# EAGLE design proto3 (EAGLE 6.1)
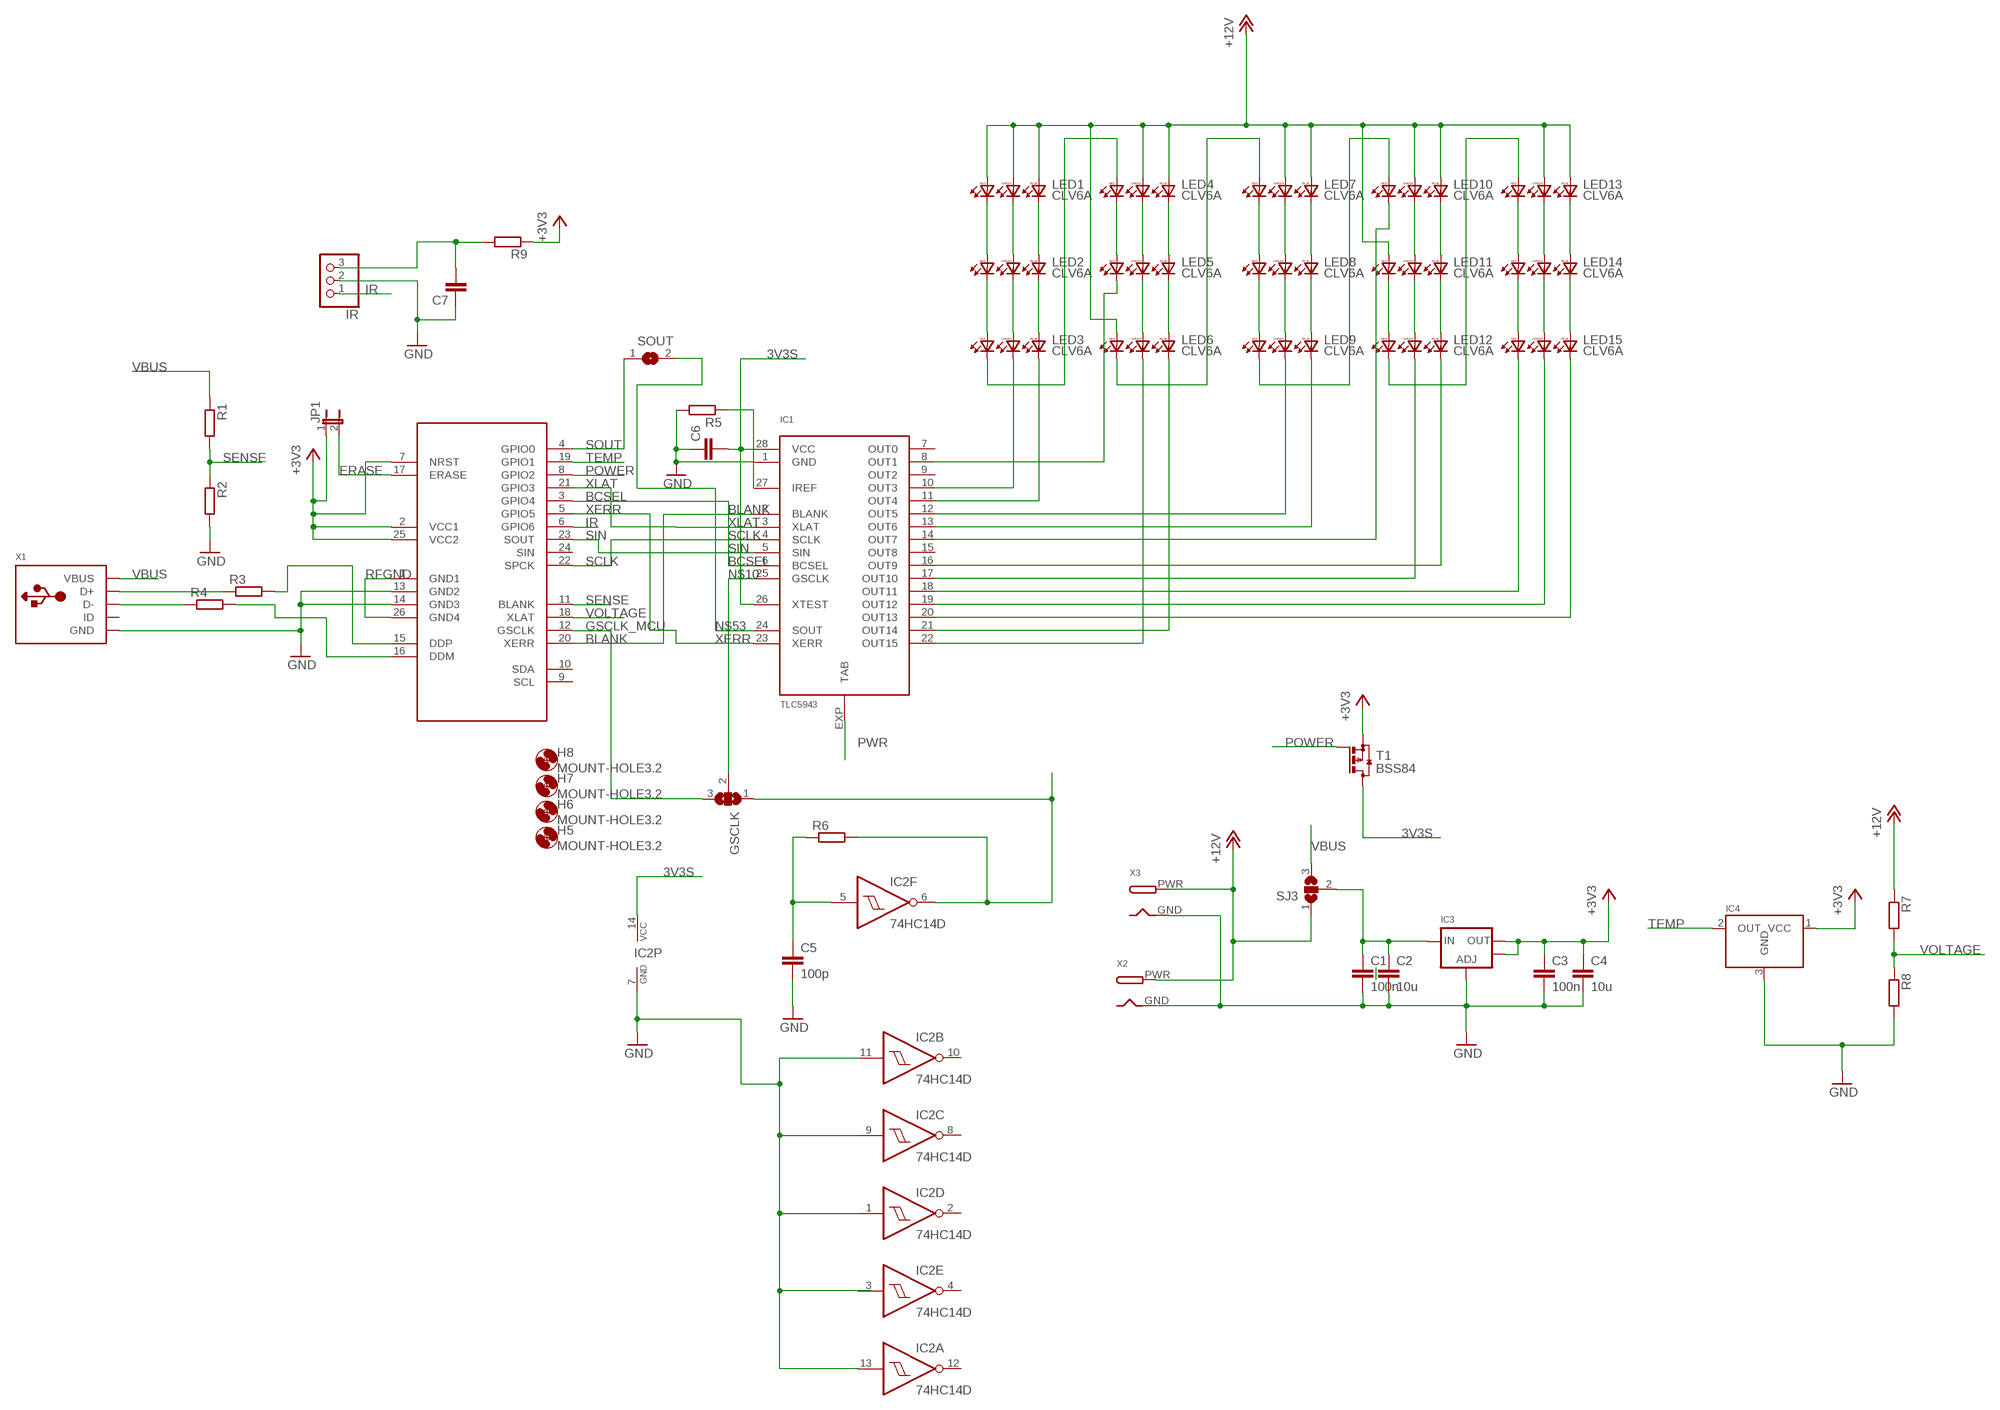
[diagram p0: schematic, sheet 1]

## Parts
C1  100n  C-EUC0805  [C0805]
C2  10u  C-EUC0805  [C0805]
C3  100n  C-EUC0805  [C0805]
C4  10u  C-EUC0805  [C0805]
C5  100p  C-EUC0805  [C0805]
C6  C-EUC0805  [C0805]
C7  C-EUC0805  [C0805]
GSCLK  SJ2W  [SJ_2]
H5  MOUNT-HOLE3.2  [3,2]
H6  MOUNT-HOLE3.2  [3,2]
H7  MOUNT-HOLE3.2  [3,2]
H8  MOUNT-HOLE3.2  [3,2]
IC1  TLC5943  [HTSSOP28PWP]
IC2  74HC14D  [SO14]
IC3  LM1117SOT223-REFLOW  [SOT223-R]
IC4  MCP9701T-E/TTCTREFLOW  [SOT23-R]
IR  PINHD-1X3  [1X03]
JP1  JP1E  [JP1]
LED1  CLV6A  [PLCC6]
LED2  CLV6A  [PLCC6]
LED3  CLV6A  [PLCC6]
LED4  CLV6A  [PLCC6]
LED5  CLV6A  [PLCC6]
LED6  CLV6A  [PLCC6]
LED7  CLV6A  [PLCC6]
LED8  CLV6A  [PLCC6]
LED9  CLV6A  [PLCC6]
LED10  CLV6A  [PLCC6]
LED11  CLV6A  [PLCC6]
LED12  CLV6A  [PLCC6]
LED13  CLV6A  [PLCC6]
LED14  CLV6A  [PLCC6]
LED15  CLV6A  [PLCC6]
R1  R-EU_R0805  [R0805]
R2  R-EU_R0805  [R0805]
R3  R-EU_R0805  [R0805]
R4  R-EU_R0805  [R0805]
R5  R-EU_R0805  [R0805]
R6  R-EU_R0805  [R0805]
R7  R-EU_R0805  [R0805]
R8  R-EU_R0805  [R0805]
R9  R-EU_R0805  [R0805]
SJ3  SJ2W  [SJ_2]
SOUT  SJ  [SJ]
T1  BSS84  [SOT23]
U$1  RFBOARD  [RFBOARD]
X1  USBMINIB  [USB-MINIB]
X2  DCBARRELPTH  [DCJACK_2MM_PTH]
X3  DCBARRELPTH  [DCJACK_2MM_PTH]

## Nets
3V3S: C6.2 IC1.26(XTEST) IC1.28(VCC) IC2.14(P:VCC) T1.3(D)
+3V3: C3.1 C4.1 IC3.2(OUT) IC3.4(OUT1) IC4.1(VCC) JP1.1 R9.1 T1.2(S) U$1.2(VCC1) U$1.7(NRST) U$1.25(VCC2)
+12V: LED1.4(RA) LED1.5(GA) LED1.6(BA) LED4.5(GA) LED4.6(BA) LED6.4(RA) LED7.5(GA) LED7.6(BA) LED10.5(GA) LED10.6(BA) LED11.4(RA) LED13.5(GA) LED13.6(BA) R7.1 SJ3.1 X2.PWR X3.PWR
BCSEL: IC1.6(BCSEL) U$1.3(GPIO4)
BLANK: IC1.2(BLANK) U$1.20(XERR)
ERASE: JP1.2 U$1.17(ERASE)
GND: C1.2 C2.2 C3.2 C4.2 C5.2 C6.1 C7.1 IC1.1(GND) IC2.1(D:I) IC2.7(P:GND) IC2.9(C:I) IC2.11(B:I) IC2.13(A:I) IC3.1(ADJ) IC4.3(GND) IR.2 R2.2 R5.2 R8.2 U$1.13(GND2) U$1.14(GND3) X1.GND X2.GND X3.GND
GSCLK_MCU: GSCLK.3 U$1.12(GSCLK)
IR: IR.1 U$1.6(GPIO6)
N$1: LED1.3(RC) LED2.4(RA)
N$2: LED1.2(GC) LED2.5(GA)
N$3: LED1.1(BC) LED2.6(BA)
N$4: LED2.3(RC) LED3.4(RA)
N$5: LED2.2(GC) LED3.5(GA)
N$6: LED2.1(BC) LED3.6(BA)
N$7: LED4.3(RC) LED5.4(RA)
N$8: LED4.2(GC) LED5.5(GA)
N$9: LED4.1(BC) LED5.6(BA)
N$10: GSCLK.2 IC1.25(GSCLK)
N$11: LED5.2(GC) LED6.5(GA)
N$12: LED5.1(BC) LED6.6(BA)
N$13: LED7.3(RC) LED8.4(RA)
N$14: LED7.2(GC) LED8.5(GA)
N$15: LED7.1(BC) LED8.6(BA)
N$16: LED8.3(RC) LED9.4(RA)
N$17: LED8.2(GC) LED9.5(GA)
N$18: LED8.1(BC) LED9.6(BA)
N$19: IC1.10(OUT3) LED3.2(GC)
N$20: LED10.2(GC) LED11.5(GA)
N$21: LED10.1(BC) LED11.6(BA)
N$22: LED11.3(RC) LED12.4(RA)
N$23: LED11.2(GC) LED12.5(GA)
N$24: LED11.1(BC) LED12.6(BA)
N$25: LED13.3(RC) LED14.4(RA)
N$26: LED13.2(GC) LED14.5(GA)
N$27: LED13.1(BC) LED14.6(BA)
N$28: LED14.3(RC) LED15.4(RA)
N$29: LED14.2(GC) LED15.5(GA)
N$30: LED14.1(BC) LED15.6(BA)
N$31: LED3.3(RC) LED4.4(RA)
N$32: LED6.3(RC) LED7.4(RA)
N$33: LED9.3(RC) LED10.4(RA)
N$34: LED12.3(RC) LED13.4(RA)
N$35: IC1.11(OUT4) LED3.1(BC)
N$36: IC1.8(OUT1) LED5.3(RC)
N$37: IC1.22(OUT15) LED6.2(GC)
N$38: IC1.21(OUT14) LED6.1(BC)
N$39: IC1.12(OUT5) LED9.2(GC)
N$40: IC1.13(OUT6) LED9.1(BC)
N$41: IC1.14(OUT7) LED10.3(RC)
N$42: IC1.17(OUT10) LED12.2(GC)
N$43: IC1.16(OUT9) LED12.1(BC)
N$44: IC1.18(OUT11) LED15.3(RC)
N$45: IC1.19(OUT12) LED15.2(GC)
N$46: IC1.20(OUT13) LED15.1(BC)
N$49: R4.2 U$1.16(DDM)
N$50: GSCLK.1 IC2.6(F:O) R6.2
N$53: IC1.24(SOUT) SOUT.2
N$55: R3.2 U$1.15(DDP)
N$57: IC1.27(IREF) R5.1
N$59: C5.1 IC2.5(F:I) R6.1
N$60: R3.1 X1.D+
N$61: C1.1 C2.1 IC3.3(IN) SJ3.2
N$62: R4.1 X1.D-
N$65: C7.2 IR.3 R9.2
POWER: T1.1(G) U$1.8(GPIO2)
PWR: IC1.EXP(TAB)
RFGND: U$1.1(GND1) U$1.26(GND4)
SCLK: IC1.4(SCLK) U$1.22(SPCK)
SENSE: R1.2 R2.1 U$1.11(BLANK)
SIN: IC1.5(SIN) U$1.23(SOUT)
SOUT: SOUT.1 U$1.4(GPIO0)
TEMP: IC4.2(OUT) U$1.19(GPIO1)
VBUS: R1.1 SJ3.3 X1.VBUS
VOLTAGE: R7.2 R8.1 U$1.18(XLAT)
XERR: IC1.23(XERR) U$1.5(GPIO5)
XLAT: IC1.3(XLAT) U$1.21(GPIO3)
Unconnected: IC1.7(OUT0) IC1.9(OUT2) IC1.15(OUT8) IC2.2(D:O) IC2.3(E:I) IC2.4(E:O) IC2.8(C:O) IC2.10(B:O) IC2.12(A:O) U$1.9(SCL) U$1.10(SDA) U$1.24(SIN) X1.ID

## Library data of the parts
C1-C7 = rcl:C-EU: CAPACITOR, European symbol
GSCLK SJ3 = jumper:SJ2W: SMD solder JUMPER
H5-H8 = holes:MOUNT-HOLE: MOUNTING HOLE with drill center marker
IC1 = xtort:TLC5943
IC2 = 74xx-eu:74*14: Hex schmitt trigger INVERTER
IC3 = xtort:LM1117: LM1117 Voltage Regulator LM1117 Adjustable Voltage regulator [Digikey: LM1117IMP-ADJDKR-ND] LM1117 3.3V Voltage regulator [AP1117E33GDIDKR-ND] LM1117 5.0V Voltage regulator [AP1117E50GDIDKR-ND] SOT223-REFLOW - SOT223 package for solder paste/reflow ovens SOT223-WAVE - SOT223 package for hand-soldering (larger pads) Note: For the fixed-voltage regulators, simply set the ADJ pin to GND.
IC4 = xtort:MCP9701T-E/TTCT
IR = pinhead:PINHD-1X3: PIN HEADER
JP1 = jumper:JP1E: JUMPER
LED1-LED15 = xtort:CLV6A: Full color RGB LED CLV6A Source: http://www.cree.com/products/pdf/ledlamps/clv6a-fkb.pdf
R1-R9 = rcl:R-EU_: RESISTOR, European symbol
SOUT = jumper:SJ: SMD solder JUMPER
T1 = transistor-small-signal:BSS84: P-CHANNEL MOS FET
U$1 = xtort:RFBOARD
X1 = xtort:USB: USB Connectors USBMINIB - Surface Mount Female Mini-B USB Connector 4UConnector: 06564
X2 X3 = xtort:DCBARREL: DC Barrel Jack DCJACK_1.3MM_PTH - Through Hole 1.3mm Jack (4UConnector: 05536) DCJACK_2MM_PTH - Through Hole 2.0/2.1 Jack (4UConnector: 05537) DCJACK_2MM_SMT - SMT 2.0/2.1mm Jack(4UConnector: 03267)

## Board
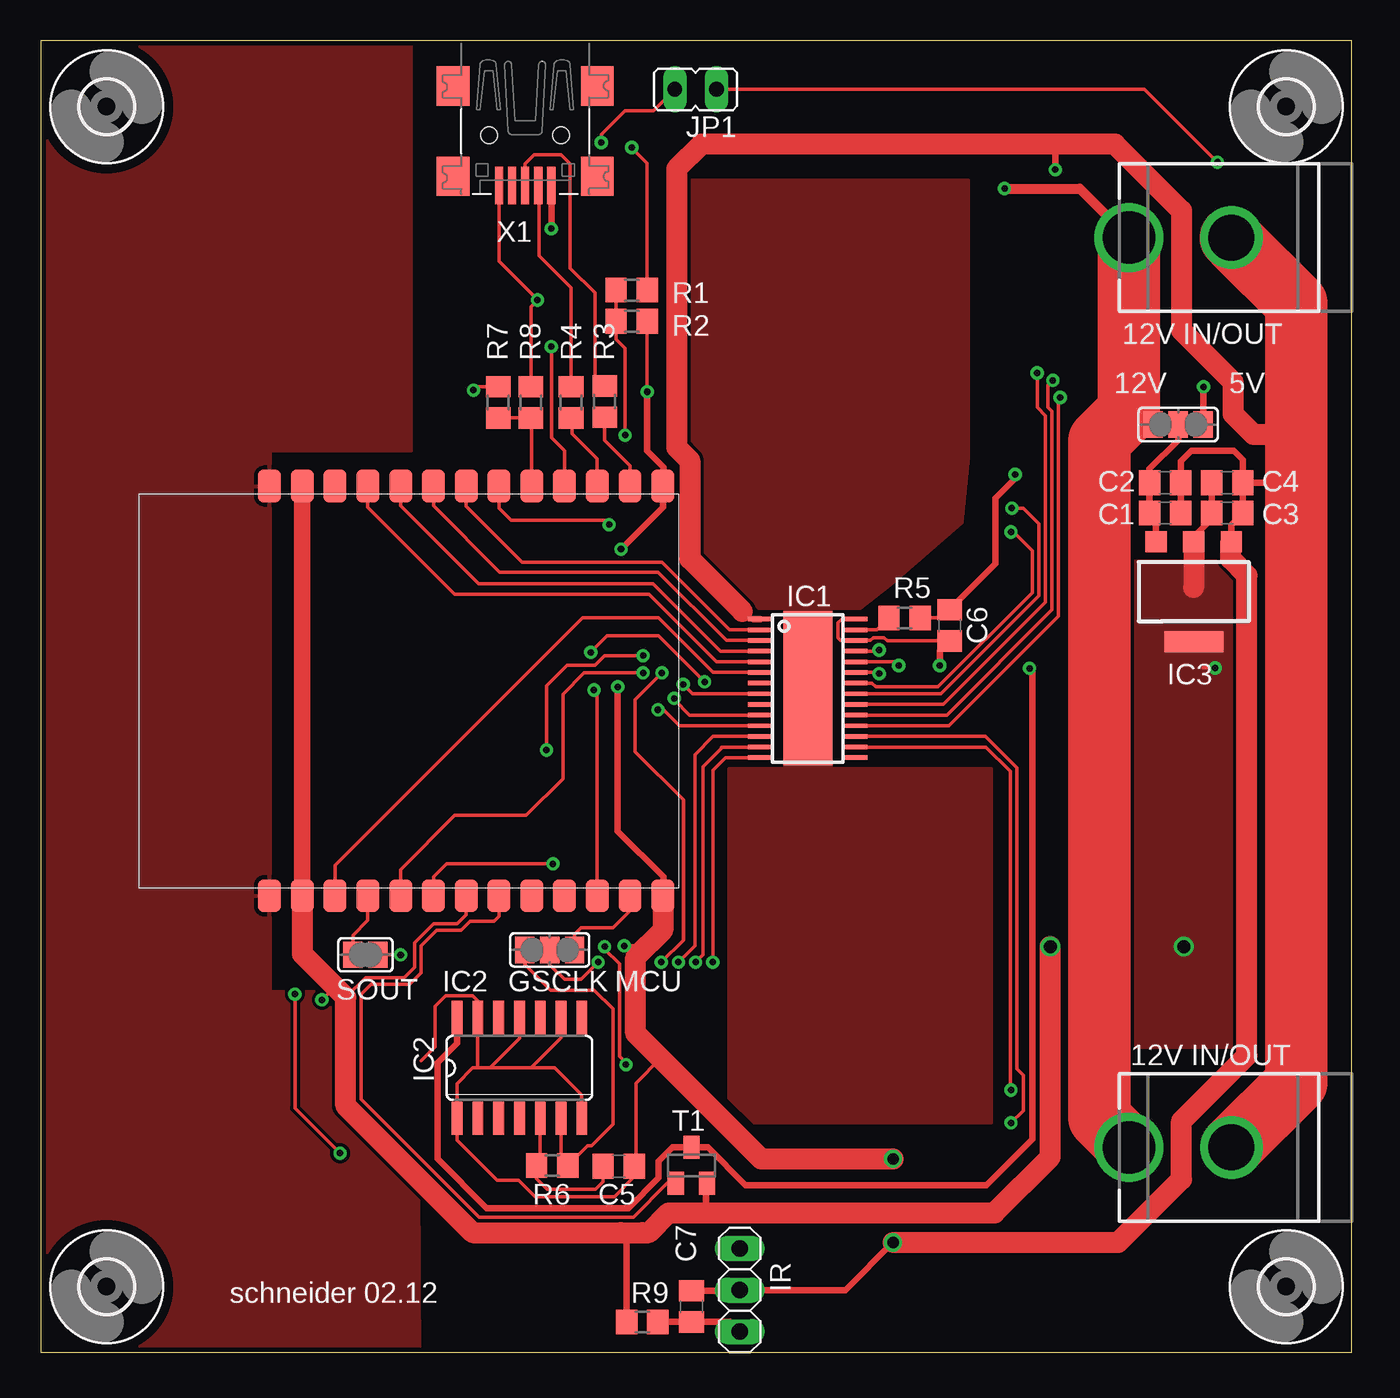
[diagram p1: board, top side]
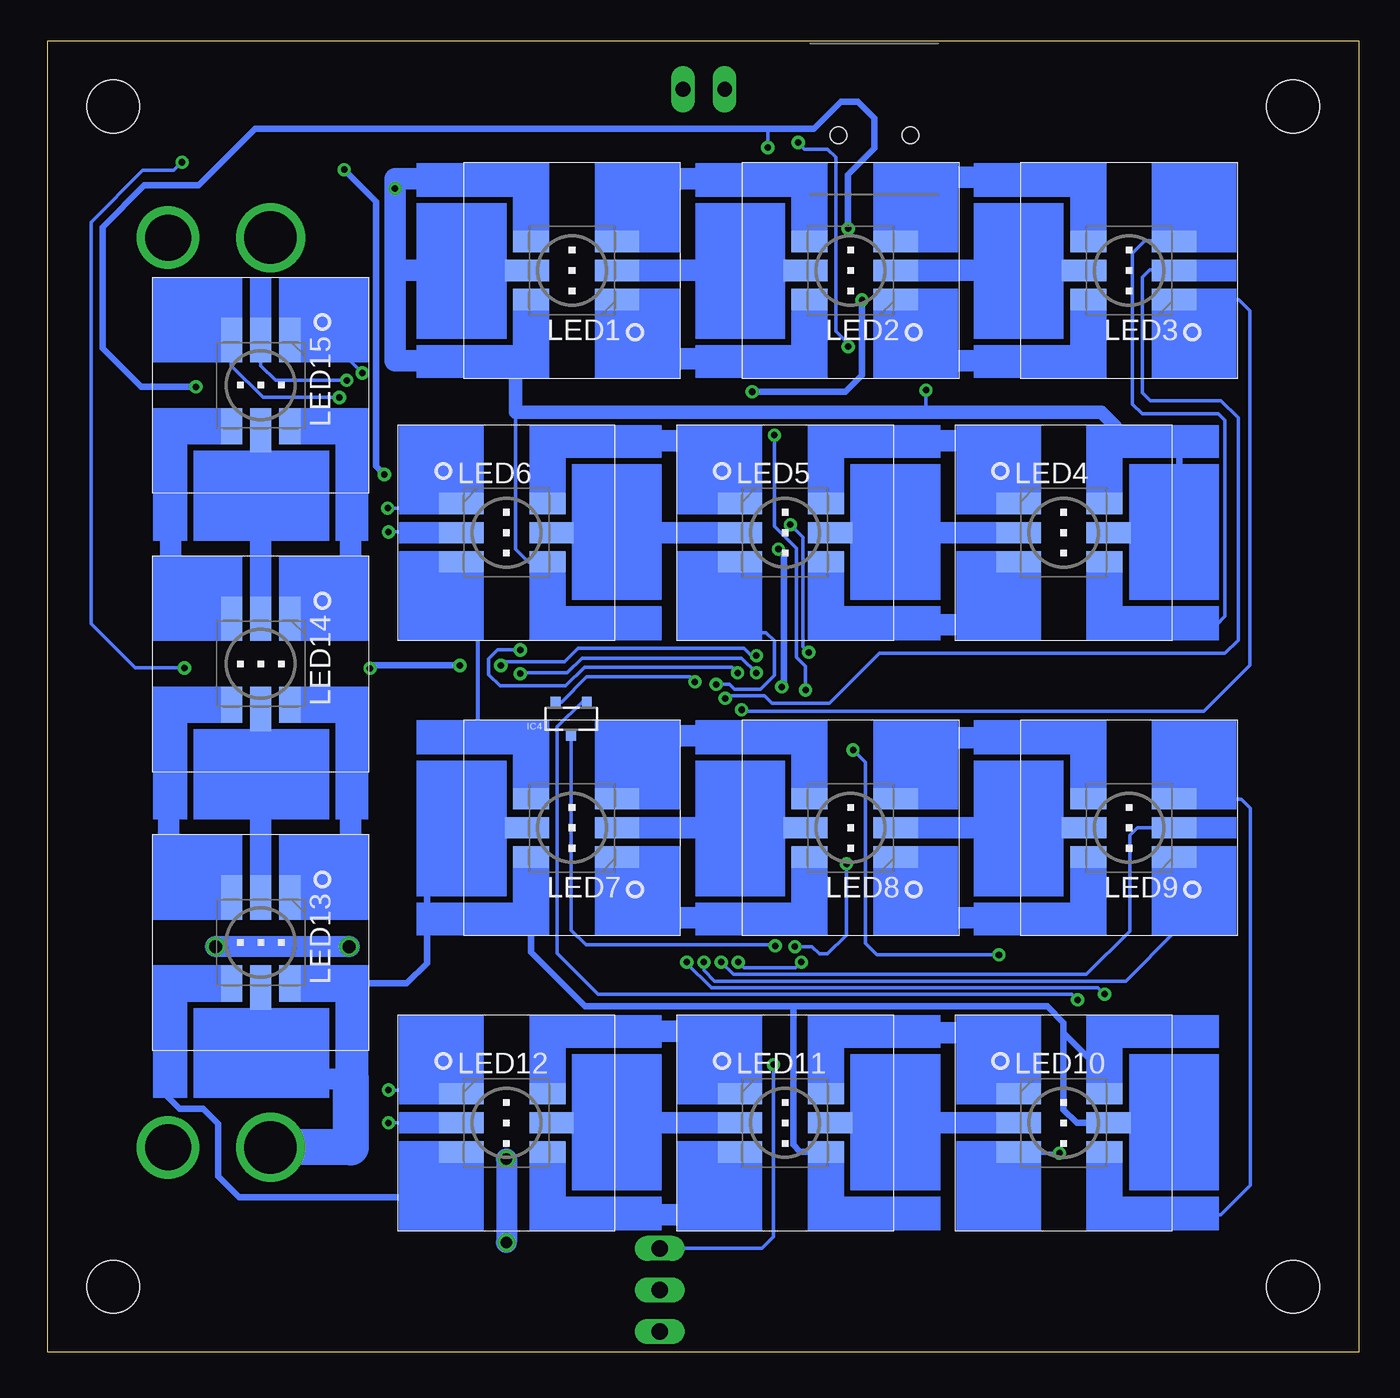
[diagram p2: board, bottom side, seen from below]

Size 80 x 80 mm. Coordinates in mm from the lower left corner, seen from the top.
Outline: 0,0 80,0 80,80 0,80 0,0
Copper layers (1*16): Top 0.035mm / dielectric 1.5mm / Bottom 0.035mm
Design rules: minimum track width 0.2mm, minimum drill 0.3mm, track to track 0.2mm, track to pad 0.2mm, pad to pad 0.2mm, via to via 0.2mm, smd to smd 0.2mm, copper to edge 0.3mm, drill to drill 8mil, minimum pad ring 10mil, minimum via ring 8mil, stop-mask expansion 4mil, vias tented up to drill 0.6mm, thermal gap 10mil

### Footprints (pad centres in the part's own frame; a part is rotated, then mirrored left to right if it is on the bottom)
C0805 = smd 1.3 x 1.5: 1 -0.95,0; 2 0.95,0
SJ_2 = smd 1.168 x 1.6: 1 -1.524,0; 2 0,0; 3 1.524,0
3,2 = hole 3.2: 0,0
HTSSOP28PWP = smd 0.27 x 1.5: 1 -4.225,-2.9; 2 -3.575,-2.9; 3 -2.925,-2.9; 4 -2.275,-2.9; 5 -1.625,-2.9; 6 -0.975,-2.9; 7 -0.325,-2.9; 8 0.325,-2.9; 9 0.975,-2.9; 10 1.625,-2.9; 11 2.275,-2.9; 12 2.925,-2.9; 13 3.575,-2.9; 14 4.225,-2.9; 15 4.225,2.9; 16 3.575,2.9; 17 2.925,2.9; 18 2.275,2.9; 19 1.625,2.9; 20 0.975,2.9; 21 0.325,2.9; 22 -0.325,2.9; 23 -0.975,2.9; 24 -1.625,2.9; 25 -2.275,2.9; 26 -2.925,2.9; 27 -3.575,2.9; 28 -4.225,2.9 | smd 9.4 x 3: EXP 0,0
SO14 = smd 0.66 x 2.032: 1 -3.81,-3.073; 2 -2.54,-3.073; 3 -1.27,-3.073; 4 0,-3.073; 5 1.27,-3.073; 6 2.54,-3.073; 7 3.81,-3.073; 8 3.81,3.073; 9 2.54,3.073; 10 1.27,3.073; 11 0,3.073; 12 -1.27,3.073; 13 -2.54,3.073; 14 -3.81,3.073
SOT223-R = smd 1.3 x 1.3: 1 -2.3,-3.05; 2 0,-3.05; 3 2.3,-3.05 | smd 3.6 x 1.3: 4 0,3.05
SOT23-R = smd 0.6 x 0.7: 1 -0.95,-1; 2 0.95,-1; 3 0,1
1X03 = drill 1.016 long: 1 -2.54,0; 2 0,0; 3 2.54,0
JP1 = drill 0.914 long: 1 0,-1.27; 2 0,1.27
PLCC6 = smd 2.7 x 1.3: 1 -2.75,1.775; 2 -2.75,0; 3 -2.75,-1.775; 5 2.75,0 | smd 2.2 x 1.3: 4 2.5,-1.775; 6 2.5,1.775
R0805 = smd 1.3 x 1.5: 1 -0.95,0; 2 0.95,0
SJ = smd 1.168 x 1.6: 1 -0.762,0; 2 0.762,0
SOT23 = smd 1 x 1.4: 1 -0.95,-1.1; 2 0.95,-1.1; 3 0,1.1
RFBOARD = smd 2 x 1.4: 1 -12.5,8; 2 -12.5,6; 3 -12.5,4; 4 -12.5,2; 5 -12.5,0; 6 -12.5,-2; 7 -12.5,-4; 8 -12.5,-6; 9 -12.5,-8; 10 -12.5,-10; 11 -12.5,-12; 12 -12.5,-14; 13 -12.5,-16; 14 12.5,-16; 15 12.5,-14; 16 12.5,-12; 17 12.5,-10; 18 12.5,-8; 19 12.5,-6; 20 12.5,-4; 21 12.5,-2; 22 12.5,0; 23 12.5,2; 24 12.5,4; 25 12.5,6; 26 12.5,8
USB-MINIB = smd 0.5 x 2.308: D+ 0,4.064; D- -0.8,4.064; GND 1.6,4.064; ID 0.8,4.064; VBUS -1.6,4.064 | smd 2 x 2.4: GND1 -4.4,-2; GND2 -4.4,3.5; GND3 4.4,3.5; GND4 4.4,-2 | hole 1: -2.2,1; 2.2,1
DCJACK_2MM_PTH = drill 2.8: GND 0,7.35 | drill 3.2: PWR 0,13.6

### Placement (x,y rotation side)
C1  68.6,51.2 0 top
C2  68.6,53.05 0 top
C3  72.4,51.2 0 top
C4  72.4,53.05 0 top
C5  35.25,11.35 0 top
C6  55.45,44.35 270 top
C7  39.7,2.8 270 top
GSCLK  31.05,24.55 0 top
H5  4,4 0 top
H6  76,4 0 top
H7  4,76 0 top
H8  76,76 0 top
IC1  46.8,40.5 270 top
IC2  29.2,17.35 0 top
IC3  70.35,46.4 180 top
IC4  48.05,38.65 180 bottom
IR  42.65,3.8 270 top
JP1  39.95,77.05 90 top
LED1  48,66 180 bottom
LED2  31,66 180 bottom
LED3  14,66 180 bottom
LED4  18,50 0 bottom
LED5  35,50 0 bottom
LED6  52,50 0 bottom
LED7  48,32 180 bottom
LED8  31,32 180 bottom
LED9  14,32 180 bottom
LED10  18,14 0 bottom
LED11  35,14 0 bottom
LED12  52,14 0 bottom
LED13  67,25 270 bottom
LED14  67,42 270 bottom
LED15  67,59 270 bottom
R1  36.05,64.8 180 top
R2  36.05,62.9 0 top
R3  34.4,58 270 top
R4  32.35,57.95 270 top
R5  52.7,44.8 0 top
R6  31.2,11.4 0 top
R7  27.9,57.95 270 top
R8  29.9,57.95 90 top
R9  36.7,1.85 0 top
SJ3  69.4,56.6 0 top
SOUT  19.8,24.25 0 top
T1  39.7,11.4 0 top
U$1  21.95,40.35 90 top
X1  29.55,75.25 180 top
X2  80,68 90 top
X3  80,12.5 90 top

### Tracks (layer width: path | path; a pad name or v marks a point on that pad's centre or on a via)
3V3S  (via drill 0.4)
  Top 0.2: IC1.28 48.88,44.73 48.65,44.5 48.65,43.6 48.8,43.45 49.65,43.45 49.7,43.4 IC1.26 50.62,43.42 50.8,43.6 51.45,43.6 51.65,43.4 C6.2 | IC2.14
  Top 0.406: IC2.14 25.4,18.85 24.2,17.65 24.2,11.8 27.2,8.8 35.85,8.8 37.7,10.65 37.7,11.65 38.55,12.5 T1.3 40.7,12.5 43,10.2 57.7,10.2 60.5,13 60.5,41.55 v60.33,41.73 | v54.85,41.9 54.85,42.8 C6.2
  Bottom 0.406: v54.85,41.9 60.15,41.9 v60.33,41.73
+3V3  (via drill 0.4, 0.4 pad 0.7, 0.8)
  Top 0.2: v17.15,21.5 17.95,22.3 | JP1.1 67.35,77.05 v71.8,72.6 | v71.65,41.75 70.95,41.75 | T1.2 40.6,10.25 | U$1.7 25.95,26.7 25.4,26.15 23.95,26.15 22.8,25 22.8,23.5 22.15,22.85 19.8,22.85 18.6,21.65
  Top 0.406: 36.85,7.15 36.7,7.3 | R9.1 35.75,6.95 35.4,7.3 | 40.6,10.25 40.6,8.5 | C4.1 C3.1 71.45,50.85 70.35,49.75 IC3.2
  Top 1.016: U$1.2 U$1.25
  Top 1.27: U$1.2 15.95,24.3 17.95,22.3 18.6,21.65 18.6,15.05 26.35,7.3 35.4,7.3 36.7,7.3 37.1,7.3 38.3,8.5 40.6,8.5 58.2,8.5 61.6,11.9 v61.6,24.75 | IC3.2 70.35,46.65
  Bottom 0.2: 65.35,24.75 67.65,24.75 | v17.15,21.5 17.5,21.85 46.4,21.85 48.9,24.35 48.9,38.15 47.4,39.65 IC4.1 | v71.8,72.6 72.3,72.1 74.2,72.1 77.35,68.95 77.35,44.45 74.65,41.75 v71.65,41.75
  Bottom 1.27: v61.6,24.75 67.65,24.75 v69.75,24.75
  pour Top (no thermals): 65.75,47.85 65.8,19 77.2,19 77.15,47.85
+12V  (via drill 0.4 pad 0.7)
  Top 0.2: R7.1 26.6,58.9 v26.4,58.7
  Top 0.406: SJ3.1 65.85,56.6 65.72,56.73
  Top 0.61: v58.8,71 63.4,71 X2.PWR
  Top 3.81: X2.PWR 66.4,57.4 65.72,56.73 64.6,55.6 64.6,14.3 X3.PWR
  Bottom 0.2: 51.45,57.35 51.45,49 50.65,48.2 49.52,48.2 | 15.2,49.95 LED4.5 | 25,57.4 24.95,57.35 | v26.4,58.7 26.4,57.4 26.35,57.35
  Bottom 0.406: 18,19.5 15.5,17 | LED10.5 17.2,14 18,14.8 18,19.5 | LED11.4 34.08,12.22 34.5,12.65 34.5,21.1 | 13.85,55.5 10.95,55.5 10.95,49.95 15.2,49.95 | 18,19.5 18,20.1 19,21.1 34.5,21.1 | 34.5,21.1 47.2,21.1 50.5,24.4 50.5,26.3 | 50.5,26.3 50.5,26.5 | 61.5,22.5 58.1,22.5 56.85,23.75 56.85,26.4 | 56.85,26.4 56.85,30.1 54.95,32 LED7.5 | 56.85,26.4 50.6,26.4 50.5,26.3
  Bottom 0.813: 32.52,12.25 LED11.4 | 13.85,55.5 15.7,57.35 24.95,57.35 26.35,57.35 51.45,57.35 51.45,60.5 | 49.52,48.2 LED6.4
  Bottom 1.27: LED13.5 67,16.7 61.5,16.7 61.5,22.5 LED13.6
  Bottom 1.3: LED7.6 50.5,26.5 | LED4.6 15.5,55.5 13.85,55.5 | LED1.6 50.5,60.5 51.45,60.5 58.8,60.5 58.8,66 | LED1.5 58.8,66 | LED1.4 50.5,71.6 58.8,71.6 v58.8,71 58.8,66 | LED10.6 15.5,17 15.5,19.6
  Bottom 2.184: 61.5,16.7 61.5,12.5 X3.PWR
BCSEL
  Top 0.2: 18,27.7 17.95,27.7 U$1.3 17.95,29.7 33.05,44.8 37.7,44.8 41.02,41.48 IC1.6
BLANK
  Top 0.2: IC1.2 42.02,44.08 37.9,48.2 29.35,48.2 25.95,51.6 U$1.20
ERASE  (via drill 0.4 pad 0.7)
  Top 0.2: U$1.17 31.95,55 31.15,55.8 v31.15,61.35 31.2,61.4 | v34.2,73.8 34.2,74.3 35.65,75.75 37.38,75.75 JP1.2
  Bottom 0.2: v31.15,61.35 31.15,61.55 31.9,62.3 31.9,62.65 31.9,63 31.9,72.9 32.4,73.4 33.8,73.4 v34.2,73.8
GND  (via drill 0.4, 0.4 pad 0.7, 0.7, 0.7 pad 0.7)
  Top 0.2: 26.65,17.35 26.35,17.35 25.39,16.39 IC2.1 25.4,14.27 25.4,12.95 27.85,10.5 29.15,10.5 30.15,9.5 35,9.5 36.2,10.7 C5.2 36.33,11.48 36.33,16.43 37.83,17.93 | 33.01,15.19 IC2.7 33,15.7 31.35,17.35 29.9,17.35 | 36.75,24.75 36.7,24.8 36.5,24.8 | 36.3,24.1 36.45,24.25 36.45,24.75 | 36.45,24.75 36.45,24.8 | R5.2 54.95,44.8 C6.1 | 72.6,49.4 IC3.1 | X2.GND 72.65,67.95 72.9,67.7 | X1.GND 27.95,66.55 v30.3,64.2 29.9,63.8 R8.2 | 76.5,56 76.6,56.1 | R2.2 v37,58.6 | 36.5,24.8 v35.6,24.8 | 36.5,24.8 36.45,24.75 | 26.65,17.35 IC2.13 26.65,20.43 26.65,21.45 26.35,21.75 24.7,21.75 24.05,21.1 24.05,18.65 23.2,17.8 | 26.65,17.35 27.4,17.35 | 27.4,17.35 29.2,19.15 IC2.11 | 27.4,17.35 29.9,17.35 | 29.9,17.35 31.75,19.2 IC2.9
  Top 0.305: 61.95,73.6 62.05,73.7 | 43.48,44.73 43.27,44.73 42.8,45.2
  Top 0.406: 38,52.8 U$1.14 | v59.45,53.55 59.45,53.3 58.25,52.1 58.25,48.1 C6.1 | IC1.1 43.48,44.73 | U$1.14 37.95,51.55 v35.4,49 | v35.2,40.6 35.2,31.8 38,29 38,27.8 U$1.13 | v37,58.6 37,55 38,54 38,52.9 U$1.14 | C4.2 C3.2 72.65,50.5 IC3.1 | v61.9,72.15 61.9,73.55 61.95,73.6 | v52,6.7 49.1,3.8 IR.2 42.6,3.75 C7.1 | C4.2 73.35,54.45 72.8,55 70.2,55 69.55,54.35 C2.2 C1.2 | C4.2 76.6,53.05
  Top 1.27: U$1.14 37.95,52.7 38,52.65 | U$1.13 37.95,25.75 36.3,24.1 36.3,19.45 37.83,17.93 43.95,11.8 v52,11.8 | v52,6.7 65.75,6.7 69.6,10.55 69.6,14.1 73.6,18.1 73.6,47.4 72.6,48.4 72.6,49.4 | 42.8,45.2 39.6,48.4 39.6,54.4 38.8,55.2 38.8,72.2 40.3,73.7 62.05,73.7 65.55,73.7 69.6,69.65 69.6,62.35 72.75,59.2 72.75,57.25 74,56 76.6,56 77,56 | 76.55,59.25 76.6,59.2
  Top 3.81: X3.GND 76.6,16.45 76.6,53.05 76.6,56 76.6,56.1 76.6,59.2 76.6,64 72.9,67.7 72.6,68
  Bottom 0.2: IC4.3 48.05,25.75 47.15,24.85 35.65,24.85 v35.6,24.8
  Bottom 0.406: v59.45,53.55 59.95,54.05 59.95,70.2 v61.9,72.15 | v30.3,64.2 30.3,59.6 31.3,58.6 v37,58.6 | v35.2,40.6 35.05,40.75 35.05,48.65 v35.4,49
  Bottom 1.27: v52,11.8 v52,6.7
GSCLK_MCU
  Top 0.2: U$1.12 35.95,26.95 34.9,25.9 32.95,25.9 32.55,25.5 32.55,24.57 GSCLK.3
IR  (via drill 0.4, 0.4 pad 0.7)
  Top 0.2: v31.25,29.8 24.75,29.8 23.95,29 U$1.6 | v35.7,17.55 35.7,17.65 35.3,18.05 35.3,23.7 34.4,24.6 v34.4,24.75
  Bottom 0.2: v31.25,29.8 31.25,25.45 32.4,24.3 32.9,24.3 33.35,24.75 v34.4,24.75 | v35.7,17.55 35.7,7.05 36.4,6.35 IR.1
N$1
  Bottom 1.3: LED2.4 33.5,71.6 45.2,71.6 45.2,67.78 LED1.3
N$2
  Bottom 1.3: LED1.2 LED2.5
N$3
  Bottom 1.3: LED2.6 33.5,60.6 45.1,60.6 45.1,64.22 LED1.1
N$4
  Bottom 1.3: LED3.4 16.5,71.7 28.2,71.7 28.2,67.78 LED2.3
N$5
  Bottom 1.3: LED3.5 LED2.2
N$6
  Bottom 1.3: LED3.6 16.5,60.5 28.2,60.5 28.2,64.22 LED2.1
N$7
  Bottom 1.3: LED5.4 32.5,44.4 20.7,44.4 20.7,48.23 LED4.3
N$8
  Bottom 1.3: LED5.5 LED4.2
N$9
  Bottom 1.3: LED5.6 32.5,55.6 20.7,55.6 20.7,51.77 LED4.1
N$10  (via drill 0.4, 0.4 pad 0.7)
  Top 0.2: v37.9,41.45 36.25,39.8 36.25,36.65 39.2,33.7 39.2,25.15 v37.85,23.8 | IC1.25 51.08,42.77 v51.15,42.85 | v34,23.8 32.95,22.75 31.95,22.75 31.05,23.65 GSCLK.2
  Bottom 0.2: v37.9,41.45 38.25,41.8 47.25,41.8 48.4,40.65 52.4,40.65 53.1,41.35 53.1,42.3 52.55,42.85 v51.15,42.85 | v37.85,23.8 37.5,23.45 34.35,23.45 v34,23.8
N$11
  Bottom 1.3: LED6.5 LED5.2
N$12
  Bottom 1.3: LED6.6 49.5,55.6 38.2,55.6 38.2,51.77 LED5.1
N$13
  Bottom 1.3: LED8.4 33.5,37.6 44,37.6 44,33.77 LED7.3
N$14
  Bottom 1.3: LED8.5 LED7.2
N$15
  Bottom 1.3: LED8.6 33.5,26.5 45.2,26.5 45.2,30.23 LED7.1
N$16
  Bottom 1.3: LED9.4 16.5,37.5 27.8,37.5 27.8,33.77 LED8.3
N$17
  Bottom 1.3: LED9.5 LED8.2
N$18
  Bottom 1.3: LED9.6 16.5,26.5 28.2,26.5 28.2,30.23 LED8.1
N$19  (via drill 0.4)
  Top 0.2: IC1.10 39.58,38.88 38.65,39.8 v38.65,39.9
  Bottom 0.2: LED3.2 11.25,65.95 11.35,66.05 12.75,66.05 13.2,65.6 13.2,58.55 12.7,58.05 8.4,58.05 7.35,57 7.35,43.45 8.15,42.65 29.25,42.65 32.3,39.6 35.8,39.6 36.25,40.05 38.5,40.05 v38.65,39.9
N$20
  Bottom 1.3: LED11.5 LED10.2
N$21
  Bottom 1.3: LED11.6 32.5,19.5 21.5,19.5 21.5,15.78 LED10.1
N$22
  Bottom 1.3: LED12.4 49.5,8.4 38.9,8.4 38.9,12.22 LED11.3
N$23
  Bottom 1.3: LED12.5 LED11.2
N$24
  Bottom 1.3: LED12.6 49.5,19.6 37.7,19.6 37.7,15.78 LED11.1
N$25
  Bottom 1.3: LED14.4 72.6,39.5 72.6,28.3 68.78,28.3 LED13.3
N$26
  Bottom 1.3: LED14.5 LED13.2
N$27
  Bottom 1.3: LED14.6 61.5,39.5 61.5,29.1 65.22,29.1 LED13.1
N$28
  Bottom 1.3: LED15.4 72.5,56.5 72.5,45.8 68.78,45.8 LED14.3
N$29
  Bottom 1.3: LED15.5 LED14.2
N$30
  Bottom 1.3: LED15.6 61.5,56.5 61.5,46.2 65.22,46.2 LED14.1
N$31
  Bottom 0.2: LED4.4 15.5,44.4 8.65,44.4 8.15,44.9 8.15,56.85 8.55,57.25 13.2,57.25 13.8,57.85 13.8,67.05 13.05,67.8 11.25,67.8 LED3.3
N$32
  Bottom 0.254: LED6.3 53.75,48.23 53.75,37.4 50.5,37.4 LED7.4
N$33
  Bottom 0.2: 15.5,8.4 8.4,8.4 6.6,10.2 6.6,33.2 7.15,33.75 11.22,33.75 | 11.22,33.75 11.25,33.75 | LED9.3 11.22,33.75
  Bottom 0.254: LED10.4 15.5,8.4
  Bottom 0.406: 15.5,12.2 LED10.4
N$34
  Bottom 0.2: 57.52,9.45 LED12.3 | 72.8,22.4 72.8,15.8
  Bottom 0.406: 72.8,22.4 68.78,22.4 LED13.4 | 57.52,9.45 68.3,9.45 69.6,10.75 69.6,13.95 70.5,14.85 71.95,14.85 72.8,15.7 72.8,15.8
N$35  (via drill 0.4)
  Top 0.2: IC1.11 38.98,38.23 38,39.2 v37.65,39.2
  Bottom 0.2: LED3.1 11.22,64.2 7.3,64.2 6.65,63.55 6.65,41.9 9.45,39.1 37.8,39.1 37.7,39.2 v37.65,39.2
N$36  (via drill 0.4)
  Top 0.2: IC1.8 39.77,40.17 v39.2,40.75
  Bottom 0.2: 38.1,48.2 37.8,48.2 37.75,48.25 LED5.3 36.95,47.42 36.95,43.9 36.15,43.9 35.65,43.4 35.65,41.3 36.5,40.45 38.1,40.45 38.4,40.75 v39.2,40.75
N$37  (via drill 0.4)
  Top 0.2: IC1.22 50.73,40.83 50.95,40.6 54.75,40.6 60.5,46.35 60.5,48.9 59.35,50.05 v59.2,50.05
  Bottom 0.2: LED6.2 54.8,50.05 v59.2,50.05
N$38  (via drill 0.4)
  Top 0.2: IC1.21 54.92,40.17 60.9,46.15 60.9,50.55 59.95,51.5 v59.25,51.5
  Bottom 0.2: 54.42,51.45 LED6.1 55.02,51.5 v59.25,51.5
N$39  (via drill 0.4)
  Top 0.2: IC1.12 41.02,37.58 39.9,36.45 39.9,24.8 v38.9,23.8
  Bottom 0.2: 10.25,32 LED9.2 13.5,32 13.95,31.55 13.95,25.7 16.6,23.05 38.15,23.05 v38.9,23.8
N$40  (via drill 0.4)
  Top 0.2: IC1.13 41.6,36.92 | 41.6,36.92 41.52,36.92 | 41.6,36.92 40.4,35.73 40.4,24.25 v39.95,23.8
  Bottom 0.2: LED9.1 11.2,30.18 11.2,25.65 14.2,22.65 39.3,22.65 39.95,23.3 v39.95,23.8
N$41  (via drill 0.4)
  Top 0.2: IC1.14 41.77,36.27 41,35.5 v41,23.8 | v15.5,21.85 15.5,14.9 v18.25,12.15
  Bottom 0.2: v18.25,12.15 20.68,12.15 LED10.3 | v15.5,21.85 15.9,22.25 39.5,22.25 41,23.75 v41,23.8
N$42  (via drill 0.4)
  Top 0.2: IC1.17 57.62,37.58 59.55,35.65 59.55,17.3 59.95,16.9 59.95,14.75 v59.2,14
  Bottom 0.2: v59.2,14 LED12.2
N$43  (via drill 0.4)
  Top 0.2: IC1.16 57.67,36.92 59.15,35.45 59.15,16.15 59.3,16 v59.2,16
  Bottom 0.2: LED12.1 55.02,16.05 55.08,16 v59.2,16
N$44  (via drill 0.4)
  Top 0.2: IC1.18 55.42,38.23 62.1,44.9 62.1,58.15 v62.2,58.25
  Bottom 0.2: v62.2,58.25 66.85,58.25 68.8,60.2 68.8,61.73 LED15.3
N$45  (via drill 0.4)
  Top 0.2: IC1.19 55.27,38.88 61.7,45.3 61.7,57.4 61.45,57.65 61.45,59 v61.75,59.3
  Bottom 0.2: LED15.2 67,60.2 66.1,59.3 v61.75,59.3
N$46  (via drill 0.4)
  Top 0.2: IC1.20 55.08,39.52 61.3,45.75 61.3,57.15 60.8,57.65 v60.8,59.75
  Bottom 0.2: LED15.1 62.8,61.75 v60.8,59.75
N$49
  Top 0.2: U$1.16 33.95,54.5 32.4,56.05 32.4,56.95 R4.2
N$50
  Top 0.2: IC2.6 31.74,11.81 R6.2 33.35,12.6 33.6,12.6 34.9,13.9 34.9,20.95 33.75,22.1 31.1,22.1 29.55,23.65 29.55,24.53 GSCLK.1
N$53  (via drill 0.4, 0.4 pad 0.7)
  Top 0.2: IC1.24 52.12,42.12 v52.35,41.9 | v21.95,24.25 SOUT.2 | v30.85,36.75 30.85,40.65 32.1,41.9 33.8,41.9 34.4,42.5 v36.75,42.5
  Bottom 0.2: v52.35,41.9 52.12,42.12 48.47,42.12 47.64,42.95 37.5,42.95 37.05,42.5 v36.75,42.5 | v30.85,36.75 30.1,36 30.1,24.95 29.4,24.25 v21.95,24.25
N$55
  Top 0.2: U$1.15 35.95,54.1 34.4,55.65 R3.2
N$57
  Top 0.2: IC1.27 51.02,44.08 R5.1
N$59
  Top 0.2: IC2.5 30.47,11.62 R6.1 30.25,10.6 30.9,9.95 33.85,9.95 34.3,10.4 34.3,11.25 | 34.3,11.25 34.4,11.35 | 34.3,11.25 C5.1
N$60
  Top 0.2: X1.D+ 29.55,72.5 30.1,73.05 31.75,73.05 32.3,72.5 32.3,66.15 33.8,64.65 33.8,59.15 34.2,59.15 R3.1
N$61
  Top 0.406: SJ3.2 69.4,55.65 67.65,53.9 C2.1 C1.1 68.05,50.8 IC3.3
N$62
  Top 0.2: X1.D- 30.4,71.14 30.4,66.9 31.6,65.7 31.7,65.6 32.35,64.95 R4.1
N$65
  Top 0.406: IR.3 42.06,1.85 C7.2 R9.2
POWER
  Top 0.2: U$1.8 27.95,26.6 27.65,26.3 26.2,26.3 25.65,25.75 24.15,25.75 23.2,24.8 23.2,23.15 22.5,22.45 20.15,22.45 19.55,21.85 19.55,15.45 26.75,8.25 36.15,8.25 38.2,10.3 T1.1
PWR
  pour Top (no thermals): 46,36.3 45.4,36.3 45.4,35.6 42,35.6 42,15.5 43.5,14 58,14 58,35.6 48.2,35.6 48.2,36.25
  pour Top (no thermals): 48.2,44.85 48.2,45.4 50,45.4 51.8,46.8 56.2,50.6 56.6,54.6 56.6,71.5 39.4,71.5 39.4,49.8 43.8,45.4 45.4,45.4 45.4,44.8
RFGND
  pour Top: 23.1,-0.85 23,22 14,22 14,55 22.6,55 22.6,80.5 -0.5,80.75 -0.6,-0.7
SCLK
  Top 0.2: IC1.4 41.48,42.77 37.35,46.9 26.7,46.9 21.95,51.65 U$1.22
SENSE  (via drill 0.4 pad 0.7)
  Top 0.2: U$1.11 33.95,40.2 v33.75,40.4 | v35.65,55.95 35.65,61.25 35.1,61.8 R2.1 R1.2
  Bottom 0.2: v33.75,40.4 33.75,41.85 34.3,42.4 34.3,49.05 35.65,50.4 v35.65,55.95
SIN
  Top 0.2: IC1.5 41.23,42.12 37.1,46.25 25.25,46.25 19.95,51.55 U$1.23
SOUT
  Top 0.2: SOUT.1 19.04,25.44 19.95,26.35 U$1.4
TEMP  (via drill 0.4)
  Top 0.2: U$1.19 27.95,51.5 28.7,50.75 34.41,50.75 v34.67,50.49 | v40.5,40.9 37.7,43.7 34.55,43.7 v33.55,42.7
  Bottom 0.2: IC4.2 48.65,39.65 47.1,41.2 40.8,41.2 v40.5,40.9 | v34.67,50.49 33.9,49.72 33.9,43.05 v33.55,42.7
VBUS  (via drill 0.4 pad 0.7)
  Top 0.2: R1.1 37,72.55 v36.05,73.5
  Top 0.406: X1.VBUS v31.15,68.55 | v70.95,58.9 70.95,56.63 SJ3.3
  Bottom 0.2: v36.05,73.5 36.05,74.65
  Bottom 0.406: v31.15,68.55 31.15,71.85 29.55,73.45 29.55,75.3 30.55,76.3 31.6,76.3 33.25,74.65 36.05,74.65 67.35,74.65 70.8,71.2 74.1,71.2 76.65,68.65 76.65,61.25 74.3,58.9 v70.95,58.9
VOLTAGE
  Top 0.2: U$1.18 29.95,56.95 R8.1 R7.2
XERR  (via drill 0.4)
  Top 0.2: 21.95,27.8 U$1.5 21.95,29.45 25.25,32.75 29.6,32.75 31.85,35 31.85,40.15 33.15,41.45 v36.75,41.45 | IC1.23 51.08,41.48 v51.15,41.4
  Bottom 0.2: v36.75,41.45 37.65,42.35 47.4,42.35 48.3,41.45 51.1,41.45 v51.15,41.4
XLAT
  Top 0.2: IC1.3 41.83,43.42 37.65,47.6 28,47.6 23.95,51.65 U$1.21

### Text on the board
tPlace: 12V IN/OUT | 12V | 5V | IC2 | MCU | 12V IN/OUT | schneider 02.12